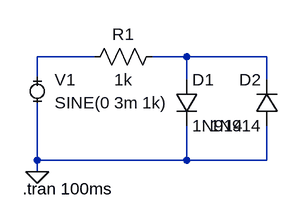
[diagram p0: schematic обмежувач.asc]
обмежувач.asc, the LTspice schematic file:
Version 4
SHEET 1 880 680
WIRE 160 128 80 128
WIRE 288 128 240 128
WIRE 400 128 288 128
WIRE 80 160 80 128
WIRE 288 160 288 128
WIRE 400 160 400 128
WIRE 80 272 80 192
WIRE 288 272 288 224
WIRE 288 272 80 272
WIRE 400 272 400 224
WIRE 400 272 288 272
WIRE 80 288 80 272
FLAG 80 288 0
SYMBOL MiniSyms4\\voltage- 80 176 R0
WINDOW 123 0 0 Left 2
WINDOW 39 0 0 Left 2
SYMATTR InstName V1
SYMATTR Value SINE(0 3m 1k)
SYMBOL res 144 144 R270
WINDOW 0 32 56 VTop 2
WINDOW 3 0 56 VBottom 2
SYMATTR InstName R1
SYMATTR Value 1k
SYMBOL diode 272 160 R0
SYMATTR InstName D1
SYMATTR Value 1N914
SYMBOL diode 416 224 R180
WINDOW 0 24 64 Left 2
WINDOW 3 24 0 Left 2
SYMATTR InstName D2
SYMATTR Value 1N914
TEXT 60 312 Left 2 !.tran 100ms

The netlist it stands for:
* обмежувач.asc
V1 N001 0 SINE(0 3m 1k)
R1 N001 N002 1k
D1 N002 0 1N914
D2 0 N002 1N914
.model D D
.lib standard.dio
.tran 100ms
.backanno
.end